# EAGLE design arduinoboardwithphotoresistors4-WillUpdate (EAGLE 8.4.1)
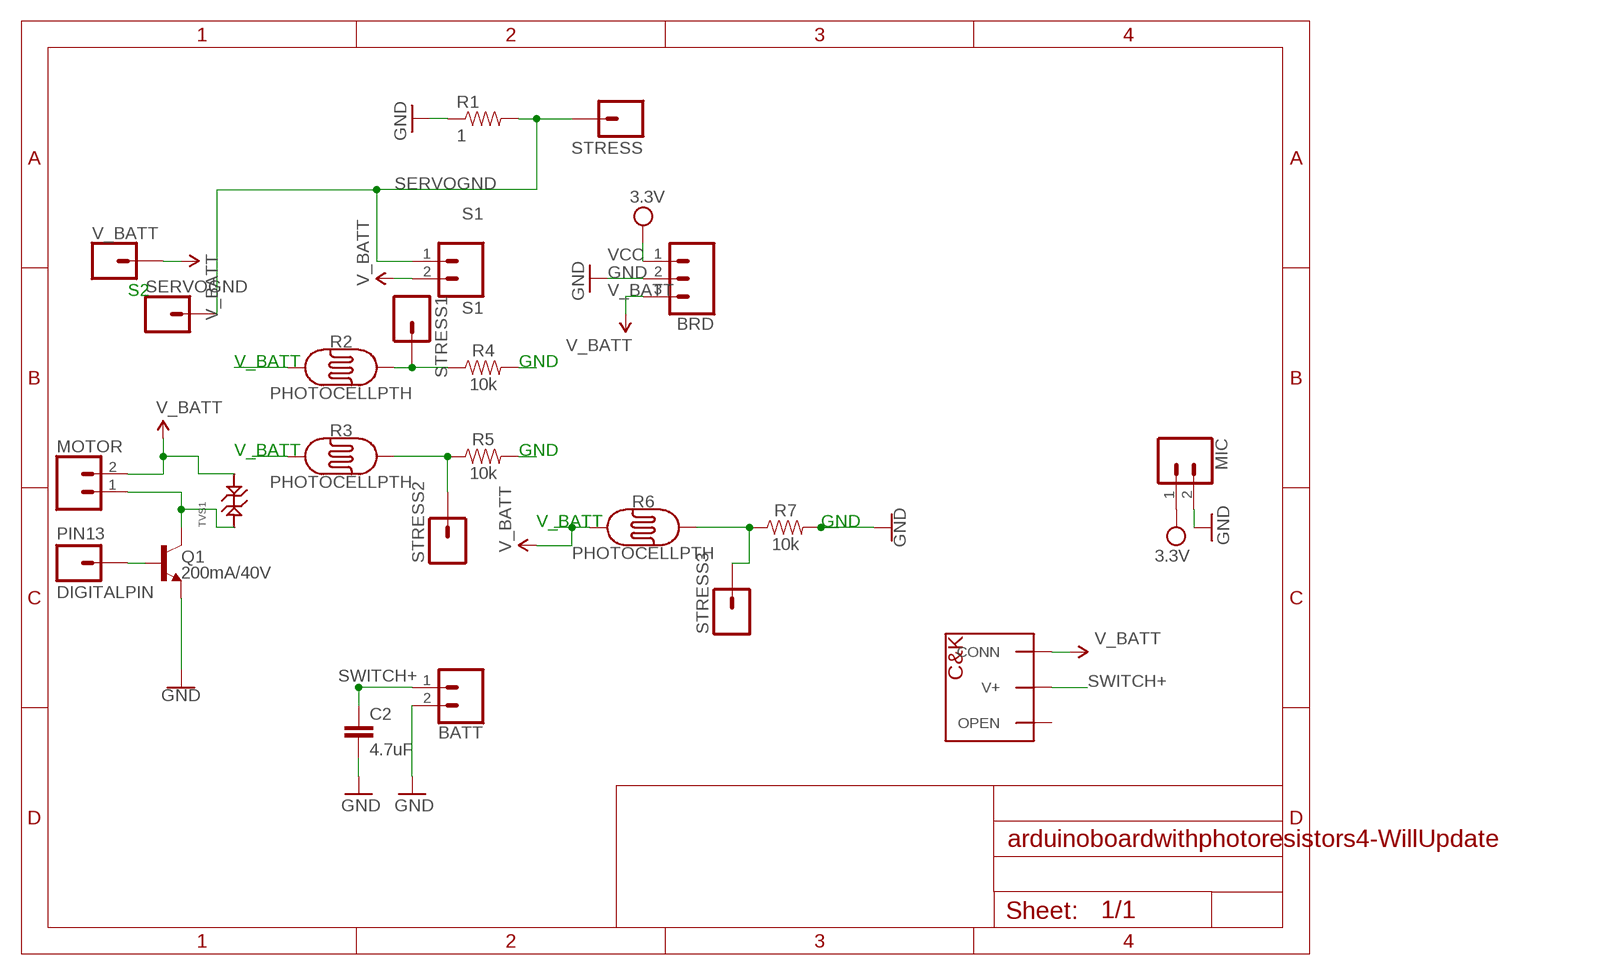
[diagram p0: schematic, sheet 1]

## Parts
BATT  CONN_02  [1X02]
BRD  CONN_03  [1X03]
C2  4.7uF  4.7UF-6.3V-10%(0603)0603  [0603-CAP]
MIC  CONN_02  [1X02]
MOTOR  CONN_02  [1X02]
PIN13  DIGITALPIN  M01PTH  [1X01]
Q1  200mA/40V  TRANS_NPN-2N3904  [TO-92]
R1  1  2.0KOHM1/10W5%(0603)  [0603-RES]
R2  PHOTOCELLPTH  [PHOTOCELL]
R3  PHOTOCELLPTH  [PHOTOCELL]
R4  10k  10KOHM-0603-1/10W-1%  [0603]
R5  10k  10KOHM-0603-1/10W-1%  [0603]
R6  PHOTOCELLPTH  [PHOTOCELL]
R7  10k  10KOHM-0603-1/10W-1%  [0603]
S1  S1  CONN_02  [1X02]
SERVOGND  CONN_01  [1X01]
STRESS  M01PTH  [1X01]
STRESS1  M01PTH  [1X01]
STRESS2  M01PTH  [1X01]
STRESS3  M01PTH  [1X01]
TVS1  TVS_DIODE_SOD-923  [SOD-923]
U$1  WILL-BLACKSLIDESWITCH  [WILL-BLACKSLIDESWITCH]
V_BATT  CONN_01  [1X01]

## Nets
GND: BATT.2 BRD.2 C2.2 MIC.2 Q1.1(E) R1.1 R4.2 R5.2 R7.2
N$2: R2.2 R4.1 STRESS1.1
N$3: R3.2 R5.1 STRESS2.1
N$4: R6.2 R7.1 STRESS3.1
N$5: PIN13.1 Q1.2(B)
N$6: MOTOR.1 Q1.3(C) TVS1.P$1
SERVOGND: R1.2 S1.1 SERVOGND.1 STRESS.1
SWITCH+: BATT.1 C2.1 U$1.V+
V_BATT: BRD.3 MOTOR.2 R2.1 R3.1 R6.1 S1.2 TVS1.P$2 U$1.CONN V_BATT.1
VCC: BRD.1 MIC.1 ; supply symbol labelled 3.3V
Unconnected: U$1.NC(OPEN)

## Notes on the sheet
- S2
- V_BATT | GND
- V_BATT | GND
- V_BATT | GND

## Library data of the parts
BATT MIC MOTOR S1 = SparkFun-Connectors:CONN_02: Multi connection point. Often used as Generic Header-pin footprint for 0.1 inch spaced/style header connections On any of the 0.1 inch spaced packages, you can populate with these: Break Away Headers - Straight <https://www.sparkfun.com/products/116> (PRT-00116) Break Away Male Headers - Right Angle <https://www.sparkfun.com/products/553> (PRT-00553) Female Headers <https://www.sparkfun.com/products/115> (PRT-00115) Break Away Headers - Machine Pin <https://www.sparkfun.com/products/117> (PRT-00117) Break Away Female Headers - Swiss Machine Pin <https://www.sparkfun.com/products/743> (PRT-00743) For SCREWTERMINALS and SPRING TERMINALS visit here: Screw Terimnals on SparkFun.com <https://www.sparkfun.com/search/results?term=Screw+Terminals> (5mm/3.5mm/2.54mm spacing) This device is also useful as a general connection point to wire up your design to another part of your project. Our various solder wires solder well into these plated through hole pads. Hook-Up Wire - Assortment (Stranded, 22 AWG) <https://www.sparkfun.com/products/11375> (PRT-11375) Hook-Up Wire - Assortment (Solid Core, 22 AWG) <https://www.sparkfun.com/products/11367> (PRT-11367) View the entire wire category on our website here <https://www.sparkfun.com/categories/141> Special notes: Molex polarized connector foot print use with: PRT-08233 with associated crimp pins and housings. 2.54_SCREWTERM for use with PRT-10571. 3.5mm Screw Terminal footprints for PRT-08084 5mm Screw Terminal footprints for use with PRT-08432
BRD = SparkFun-Connectors:CONN_03: Multi connection point. Often used as Generic Header-pin footprint for 0.1 inch spaced/style header connections On any of the 0.1 inch spaced packages, you can populate with these: Break Away Headers - Straight <https://www.sparkfun.com/products/116> (PRT-00116) Break Away Male Headers - Right Angle <https://www.sparkfun.com/products/553> (PRT-00553) Female Headers <https://www.sparkfun.com/products/115> (PRT-00115) Break Away Headers - Machine Pin <https://www.sparkfun.com/products/117> (PRT-00117) Break Away Female Headers - Swiss Machine Pin <https://www.sparkfun.com/products/743> (PRT-00743) Stackable Header - 3 Pin (Female, 0.1") <https://www.sparkfun.com/products/13875> (PRT-13875) For SCREWTERMINALS and SPRING TERMINALS visit here: Screw Terimnals on SparkFun.com <https://www.sparkfun.com/search/results?term=Screw+Terminals> (5mm/3.5mm/2.54mm spacing) This device is also useful as a general connection point to wire up your design to another part of your project. Our various solder wires solder well into these plated through hole pads. Hook-Up Wire - Assortment (Stranded, 22 AWG) <https://www.sparkfun.com/products/11375> (PRT-11375) Hook-Up Wire - Assortment (Solid Core, 22 AWG) <https://www.sparkfun.com/products/11367> (PRT-11367) View the entire wire category on our website here <https://www.sparkfun.com/categories/141> Special notes: Molex polarized connector foot print use with SKU : PRT-08232 with associated crimp pins and housings.
C2 = SparkFun-Capacitors:4.7UF-6.3V-10%(0603): CAP-08280; PROD_ID: CAP-08280
PIN13 STRESS STRESS1-STRESS3 = SparkFun-Connectors:M01: Header 1 Standard 1-pin 0.1" header. Use with straight break away headers (SKU : PRT-00116), right angle break away headers (PRT-00553), swiss pins (PRT-00743), machine pins (PRT-00117), and female headers (PRT-00115). SMTSO-256-ET is a "flush mount" nut for a 4-40 screw. The older package used to be too tight, and did not allow it to sit properly thru the drill hit. The latest (0.165DIA) fits nice and snug.
Q1 = SparkFun-DiscreteSemi:TRANS_NPN: NPN transistor Current controlled devices typically used to amplify current or used as a switch. BC547 - COM-08928 <http://www.sparkfun.com/products/8928> (TO-92 45V 100mA) (1.Collector 2.Base 3.Emitter) 2N3904 - COM-00521 <http://www.sparkfun.com/products/521> (TO-92 40V 200mA) (1.Emitter 2.Base 3.Collector) P2N2222A - COM-12852 <http://www.sparkfun.com/products/12852> (TO-92 40V 600mA) (1.Collector 2.Base 3.Emitter); PROD_ID: TRANS-08447
R1 = SparkFun-Resistors:2.0KOHM1/10W5%(0603): RES-08296; PROD_ID: RES-08296; VALUE: 2.0k
R2 R3 R6 = SparkFun-Sensors:PHOTOCELL: Photocell (Photodetector, Photo Resistor, CdS) This is a very small light sensor. A photocell changes (also called a photodetector, photo resistor, CdS or photoconductive cell) resistance depending on the amount of light it is exposed to. These little sensors make great ambient light triggers (when light in the room turns on, do something). Datasheet <http://cdn.sparkfun.com/datasheets/Sensors/LightImaging/SEN-09088.pdf> SparkFun Products Mini Photocell <https://www.sparkfun.com/products/9088> (SEN-09088); PROD_ID: COMP-09129; SF_ID: SEN-09088
R4 R5 R7 = SparkFun-Resistors:10KOHM: 10kΩ resistor A resistor is a passive two-terminal electrical component that implements electrical resistance as a circuit element. Resistors act to reduce current flow, and, at the same time, act to lower voltage levels within circuits. - Wikipedia; PROD_ID: RES-00824
SERVOGND V_BATT = SparkFun-Connectors:CONN_01: Single connection point. Often used as Generic Header-pin footprint for 0.1 inch spaced/style header connections On any of the 0.1 inch spaced packages, you can populate with these: Break Away Headers - Straight <https://www.sparkfun.com/products/116> (PRT-00116) Break Away Male Headers - Right Angle <https://www.sparkfun.com/products/553> (PRT-00553) Female Headers <https://www.sparkfun.com/products/115> (PRT-00115) Break Away Headers - Machine Pin <https://www.sparkfun.com/products/117> (PRT-00117) Break Away Female Headers - Swiss Machine Pin <https://www.sparkfun.com/products/743> (PRT-00743) This device is also useful as a general connection point to wire up your design to another part of your project. Our various solder wires solder well into these plated through hole pads. Hook-Up Wire - Assortment (Stranded, 22 AWG) <https://www.sparkfun.com/products/11375> (PRT-11375) Hook-Up Wire - Assortment (Solid Core, 22 AWG) <https://www.sparkfun.com/products/11367> (PRT-11367) View the entire wire category on our website here <https://www.sparkfun.com/categories/141> Special notes: SMTSO-256-ET is a "flush mount" nut for a 4-40 screw. We mostly use this on specialty testbeds; it is a nice way to connect hardware to your PCB at an adjustable hieght. Also note, the SNAP packages are for using a snappable style connector. We sell a baggie of snaps and they are also used on two LilyPad designs: Snap Assortment - 30 pack (male and female) <https://www.sparkfun.com/products/11347> (DEV-11347) LilyPad Arduino SimpleSnap <https://www.sparkfun.com/products/10941> (DEV-10941) LilyPad SimpleSnap Protoboard <https://www.sparkfun.com/products/10940> (DEV-10940)
TVS1 = PP_Passives:TVS_DIODE
U$1 = Will-Switch:WILL-BLACKSLIDESWITCH

## Board
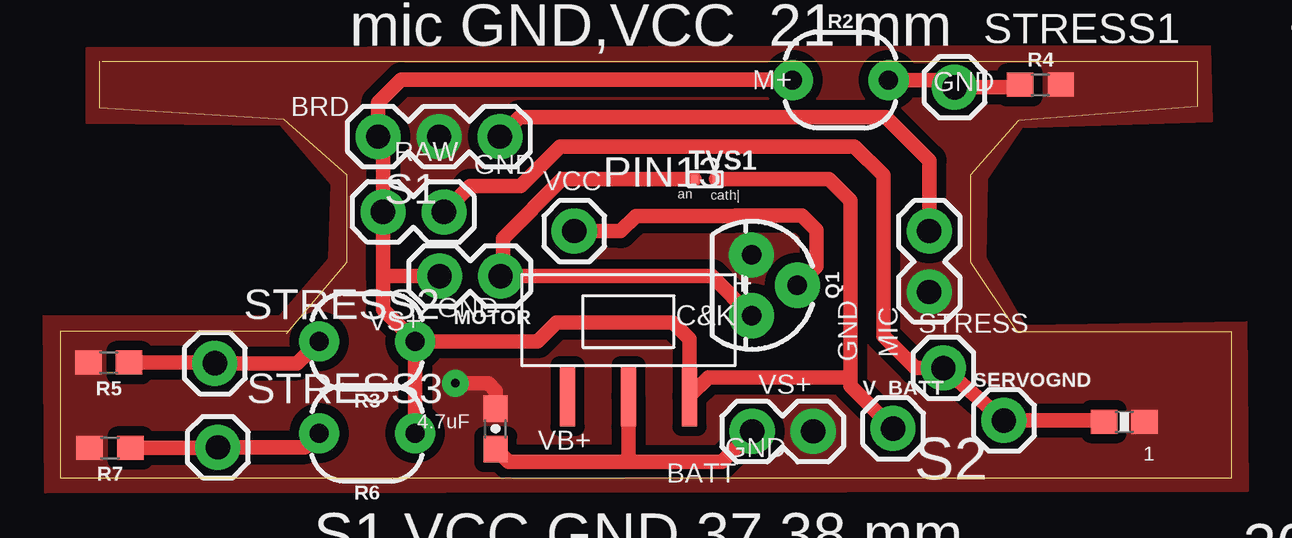
[diagram p1: board, top side]
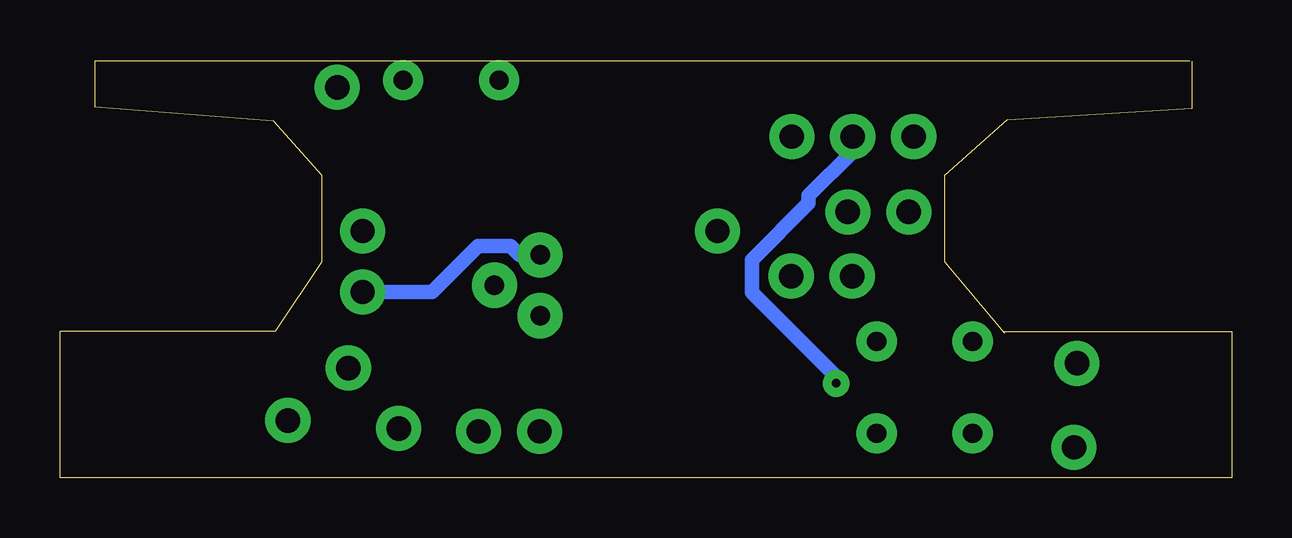
[diagram p2: board, bottom side, seen from below]

Size 48.84 x 17.37 mm. Coordinates in mm from the lower left corner, seen from the top.
Outline: 1.75,17.37 47.4,17.37 47.4,15.47 39.95,14.88 37.95,12.62 37.95,8.99 39.88,6.1 48.84,6.1 48.84,0 0,0 0,6.1 9.52,6.1
Outline: 9.45,6.02 11.96,8.99 11.96,12.62 9.35,14.94 1.65,15.42 1.65,17.37
Copper layers (1*16): Top 0.035mm / dielectric 1.5mm / Bottom 0.035mm
Design rules "OthermillDRC_1_64_v2": minimum track width 16mil, minimum drill 31mil, track to track 0.39878125mm, track to pad 0.39878125mm, pad to pad 0.39878125mm, via to via 0.39878125mm, smd to smd 0mil, copper to edge 0mil, drill to drill 1mil, minimum pad ring 0mil, minimum via ring 15mil, stop-mask expansion 1mil, vias tented up to drill 30mil, thermal gap 10mil

### Footprints (pad centres in the part's own frame; a part is rotated, then mirrored left to right if it is on the bottom)
1X02 = drill 1.016 pad 1.88: 1 0,0; 2 2.54,0
1X03 = drill 1.016 pad 1.88: 1 0,0; 2 2.54,0; 3 5.08,0
0603-CAP = smd 1.1 x 1: 1 -0.85,0; 2 0.85,0
1X01 = drill 1.016 pad 1.88: 1 0,0
TO-92 = drill 0.813 pad 1.88: 1 -1.27,0; 2 0,1.905; 3 1.27,0
0603-RES = smd 1.1 x 1: 1 -0.85,0; 2 0.85,0
PHOTOCELL = drill 0.8 pad 1.676: 1 -2,0; 2 2,0
0603 = smd 1.1 x 1: 1 -0.85,0; 2 0.85,0
SOD-923 = smd 0.3 x 0.4: P$1 -0.45,0; P$2 0.45,0
WILL-BLACKSLIDESWITCH = smd 2.54 x 0.635: CONN 5.08,6.985; NC 5.08,1.905; V+ 5.08,4.445

### Placement (x,y rotation side)
BATT  28.85,1.93 0 top
BRD  18.34,14.23 180 top
C2  18.16,2.04 90 top
MIC  36.23,10.29 270 top
MOTOR  18.36,8.41 180 top
PIN13  21.44,10.29 0 top
Q1  28.83,8.03 270 top
R1  44.36,2.34 180 top
R2  32.54,16.59 0 top
R3  12.8,5.69 180 top
R4  40.87,16.38 0 top
R5  2.03,4.8 180 top
R6  12.8,1.85 180 top
R7  2.08,1.24 180 top
S1  16,11.08 180 top
SERVOGND  39.34,2.39 0 top
STRESS  36.82,4.58 0 top
STRESS1  37.29,16.28 0 top
STRESS2  6.45,4.78 0 top
STRESS3  6.58,1.27 0 top
TVS1  26.9,12.45 0 top
U$1  19.25,8.48 270 top
V_BATT  34.72,2.06 0 top

### Tracks (layer width: path | path; a pad name or v marks a point on that pad's centre or on a via)
GND  (via drill 0.35)
  Top 0.61: v16.48,3.94 17.86,3.94 18.16,3.63 C2.2
  Bottom 0.61: 16.48,3.79 v16.48,3.94 16.48,4.2 20.01,7.73 20.01,9.09 17.65,11.45 17.65,11.76 15.8,13.61 BRD.2 | 16.48,3.79 16.48,3.66 16.54,3.66 16.54,3.79 16.48,3.79 | MIC.2 33.34,7.75 31.41,9.67 30.05,9.67 29.68,9.3 Q1.1
  pour Top (rank 6, no thermals): 1.12,17.93 47.93,18.01 48.01,14.86 40.08,14.61 38.63,12.47 38.58,9.19 40.21,6.35 49.45,6.5 49.5,-0.56 -0.61,-0.64 -0.69,6.76 9.17,6.76 11.23,9.12 11.33,12.24 9.22,14.71 1.12,14.78
N$2
  Top 0.61: R2.2 36.98,16.59 STRESS1.1 39.92,16.28 R4.1
N$3
  Top 0.61: R5.1 6.43,4.8 STRESS2.1 9.89,4.78 R3.2
N$4
  Top 0.61: R7.1 6.55,1.25 STRESS3.1 10.22,1.27 R6.2
N$5
  Top 0.61: Q1.2 31.52,8.81 31.52,10.34 30.92,10.94 28.15,10.94 28.13,10.92 24,10.92 23.37,10.29 PIN13.1
N$6
  Top 0.61: Q1.3 27.18,8.41 MOTOR.1 18.47,8.51 18.47,9.98 20.93,12.45 TVS1.P$1
SERVOGND
  Top 0.61: STRESS.1 SERVOGND.1 43.46,2.39 R1.2 | 36.72,4.47 STRESS.1 | STRESS.1 35.66,4.58 34.32,5.92 34.32,7.7 | 34.32,7.7 | 34.32,7.7 34.32,12.62 33.12,13.82 20.85,13.82 19.2,12.17 17.09,12.17 S1.1
SWITCH+
  Top 0.61: 18.32,1.2 C2.1 18.69,0.66 23.7,0.66 | 23.7,0.66 27.58,0.66 BATT.1 | U$1.V+ 23.7,0.66
V_BATT
  Top 0.61: R3.1 R6.1 | R2.1 30.51,16.61 14.22,16.61 13.26,15.65 BRD.3 13.46,14.03 S1.2 13.46,8.33 | R3.1 13.46,7.03 13.46,8.33 | MOTOR.2 13.54,8.41 13.46,8.33 | R3.1 19.91,5.69 20.7,6.48 25.55,6.48 26.24,5.79 U$1.CONN 27.02,4.19 32.94,4.19 | V_BATT.1 32.94,3.83 32.94,4.19 | 32.94,4.19 32.94,11.56 32.05,12.45 TVS1.P$2
VCC
  Top 0.61: MIC.1 36.25,10.3 36.25,13.23 34.43,15.04 19.16,15.04 BRD.1

### Text on the board
tPlace: 22 mm | RAW,GND,VCC 26 mm | 29 mm | battery 45 mm | 29 mm | stress 28 mm A7 | 14 mm | mic 16 mm A6 | mic GND,VCC 21 mm | 25 mm | M+ | GND | RAW | GND | VCC | an | cath| | + | GND | VS+ | GND | VS+ | VB+ | GND | S2 | S1 VCC,GND 37,38 mm | 30,30 mm | S2 VCC,GND 37,38 mm | 45,46 mm | S1 SIG,48 mm D5 | 37 mm | 41 mm | S1 SIG,52 mm D6 | stress / 23 mm, 33 mm, 29 mm / A0-front, A1-Back, A2-side | pin13 to 24mm